# Altium schematic sheet 01.SchDoc
size A4
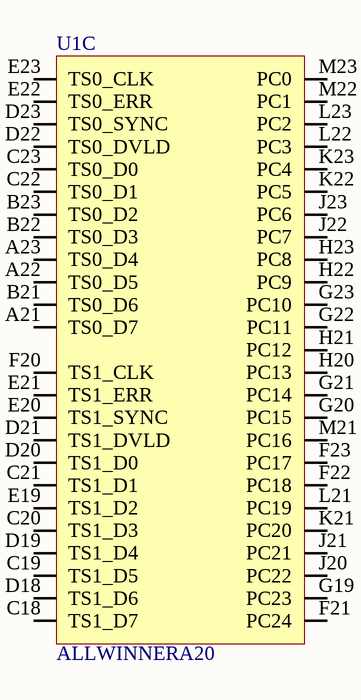
[diagram p0: 01.SchDoc]

## Parts
U1  MPN: ALLWINNERA20  [A20]  (hidden comment: Allwinner A20 SOC)  (part C of 5)

## Nets

Not connected (* = marked no-connect by the designer): U1 A21(TS0_D7) A22(TS0_D5) A23(TS0_D4) B21(TS0_D6) B22(TS0_D3) B23(TS0_D2) C18(TS1_D7) C19(TS1_D5) C20(TS1_D3) C21(TS1_D1) C22(TS0_D1) C23(TS0_D0) D18(TS1_D6) D19(TS1_D4) D20(TS1_D0) D21(TS1_DVLD) D22(TS0_DVLD) D23(TS0_SYNC) E19(TS1_D2) E20(TS1_SYNC) E21(TS1_ERR) E22(TS0_ERR) E23(TS0_CLK) F20(TS1_CLK) F21(PC24) F22(PC18) F23(PC17) G19(PC23) G20(PC15) G21(PC14) G22(PC11) G23(PC10) H20(PC13) H21(PC12) H22(PC9) H23(PC8) J20(PC22) J21(PC21) J22(PC7) J23(PC6) K21(PC20) K22(PC5) K23(PC4) L21(PC19) L22(PC3) L23(PC2) M21(PC16) M22(PC1) M23(PC0)

## Library data of the parts
U1 = ALLWINNER-A20